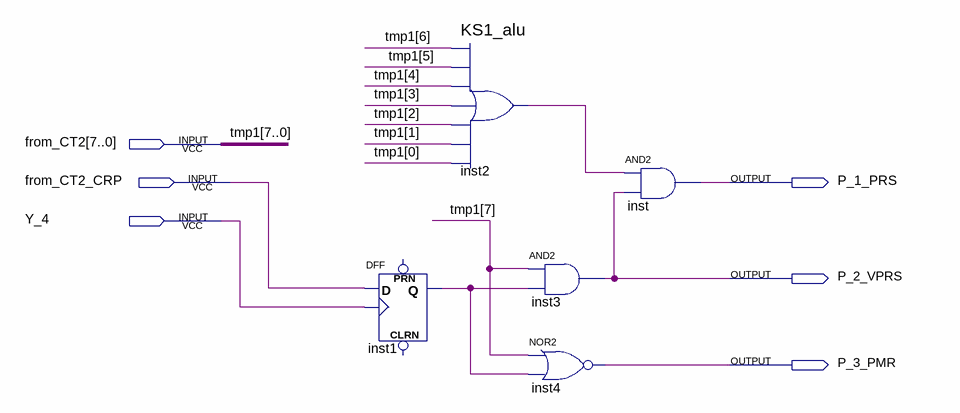
[diagram p0: schematic sheet]
// Quartus schematic KS1_T1_block.bdf as structural Verilog: 5 symbols, 6 pins
module KS1_T1_block (
  input  [7:0] from_CT2,
  input  from_CT2_CRP,
  input  Y_4,
  output P_1_PRS,
  output P_2_VPRS,
  output P_3_PMR
);

  wire inst1_q, inst2_result;

  DFF inst1 (.CLK(Y_4), .D(from_CT2_CRP), .Q(inst1_q));  // open: CLRN, PRN
  KS1_alu inst2 (
    .data0(from_CT2[6]), .data1(from_CT2[5]), .data2(from_CT2[4]), .data3(from_CT2[3]), .data4(from_CT2[2]),
    .data5(from_CT2[1]), .data6(from_CT2[0]), .result(inst2_result));
  and inst3 (P_2_VPRS, from_CT2[7], inst1_q);
  nor inst4 (P_3_PMR, from_CT2[7], inst1_q);
  and inst (P_1_PRS, inst2_result, P_2_VPRS);

  // Other names for the same wires on the sheet: tmp1[7:0] = from_CT2
endmodule
